# Altium schematic sheet 新版基于TL494的程控电源总图（17级训练）.SchDoc
size A4
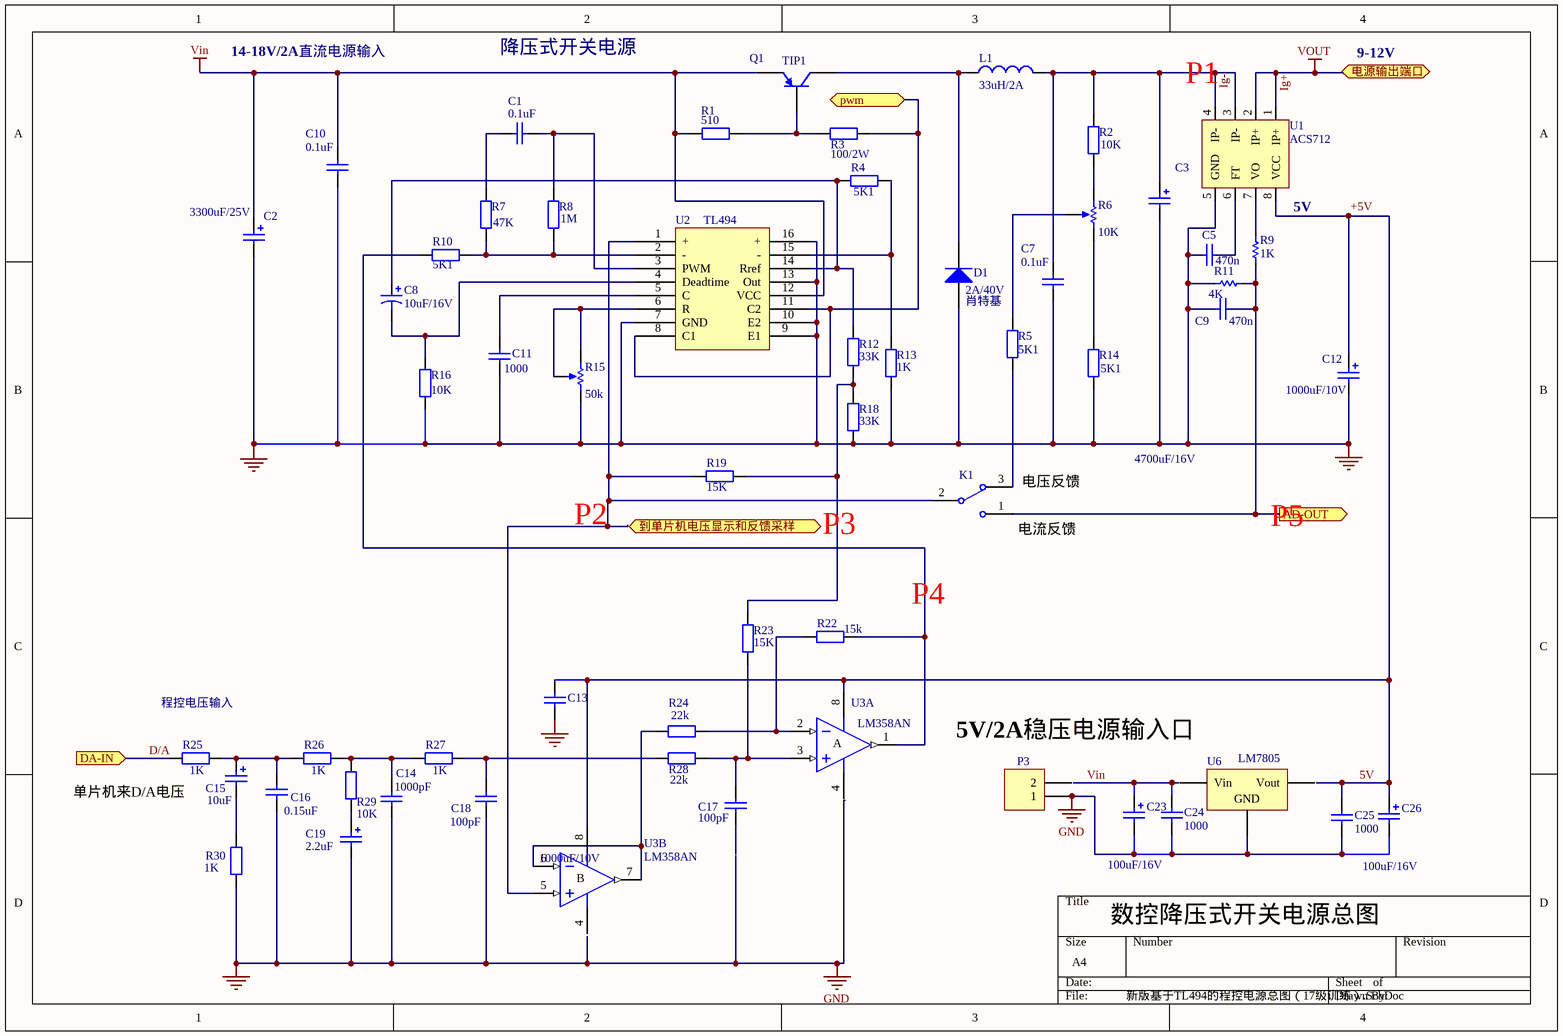
[diagram p0: 新版基于TL494的程控电源总图（17级训练）.SchDoc]

## Parts
C1  value 0.1uF  [Cap]  (hidden comment: Cap)
C2  value 3300uF/25V  [POLAR0.8]  (hidden comment: Cap Pol2)
C3  value 4700uF/16V  [POLAR0.8]  (hidden comment: Cap Pol2)
C5  value 470n  [1206]  (hidden comment: 275VAC)
C7  value 0.1uF  [RAD-0.3]  (hidden comment: Cap)
C8  value 10uF/16V  [RB7.6-15]  (hidden comment: Cap Pol1)
C9  value 470n  [1206]  (hidden comment: 275VAC)
C10  value 0.1uF  [RAD-0.3]  (hidden comment: Cap)
C11  value 1000  [Cap]  (hidden comment: Cap)
C12  value 1000uF/10V  [POLAR0.8]  (hidden comment: Cap Pol2)
C13  value 1000uF/10V  [RAD-0.3]  (hidden comment: Cap)
C14  value 1000pF  [RAD-0.3]  (hidden comment: Cap)
C15  value 10uF  [RAD-0.3]  (hidden comment: Cap Pol2)
C16  value 0.15uF  [RAD-0.3]  (hidden comment: Cap)
C17  value 100pF  [C1206]  (hidden comment: Cap Semi)
C18  value 100pF  [RAD-0.3]  (hidden comment: Cap)
C19  value 2.2uF  [RAD-0.3]  (hidden comment: Cap Pol2)
C23  value 100uF/16V  [POLAR0.8]  (hidden comment: Cap Pol2)
C24  value 1000  [RAD-0.3]  (hidden comment: Cap)
C25  value 1000  [RAD-0.3]  (hidden comment: Cap)
C26  value 100uF/16V  [POLAR0.8]  (hidden comment: Cap Pol2)
D1  2A/40V  PackageReference: 肖特基  [SMC]
K1  SW-SPDT  [TL36WW15050]  (value not drawn)
L1  value 33uH/2A  [INDC3216]  (hidden comment: Inductor)
P3  MHDR1X2  [MHDR1X2]  (value not drawn)
R1  value 510  [AXIAL-0.4]  (hidden comment: Res2)
R2  value 10K  [AXIAL-0.4]  (hidden comment: Res2)
R3  value 100/2W  [AXIAL-0.4]  (hidden comment: Res2)
R4  value 5K1  [AXIAL-0.4]  (hidden comment: Res2)
R5  value 5K1  [AXIAL-0.4]  (hidden comment: Res2)
R6  value 10K  [VR5]  (hidden comment: RPot)
R7  value 47K  [AXIAL-0.4]  (hidden comment: Res2)
R8  value 1M  [AXIAL-0.4]  (hidden comment: Res2)
R9  value 1K  [1206]  (hidden comment: 1/4W)
R10  value 5K1  [AXIAL-0.4]  (hidden comment: Res2)
R11  value 4K  [1206]  (hidden comment: 1/4W)
R12  value 33K  [AXIAL-0.4]  (hidden comment: Res2)
R13  value 1K  [AXIAL-0.4]  (hidden comment: Res2)
R14  value 5K1  [AXIAL-0.4]  (hidden comment: Res2)
R15  value 50k  [VR5]  (hidden comment: RPot)
R16  value 10K  [AXIAL-0.4]  (hidden comment: Res2)
R18  value 33K  [AXIAL-0.4]  (hidden comment: Res2)
R19  value 15K  [AXIAL-0.4]  (hidden comment: Res2)
R22  value 15k  [AXIAL-0.3]  (hidden comment: Res2)
R23  value 15K  [AXIAL-0.4]  (hidden comment: Res2)
R24  value 22k  [AXIAL-0.3]  (hidden comment: Res2)
R25  value 1K  [AXIAL-0.4]  (hidden comment: Res2)
R26  value 1K  [AXIAL-0.4]  (hidden comment: Res2)
R27  value 1K  [AXIAL-0.4]  (hidden comment: Res2)
R28  value 22k  [AXIAL-0.3]  (hidden comment: Res2)
R29  value 10K  [AXIAL-0.4]  (hidden comment: Res2)
R30  value 1K  [AXIAL-0.4]  (hidden comment: Res2)
TIP1  Q1  [SOT-23B_N]
U1  ACS712  [IR2111S_dip]
U2  TL494  [DIP16]
U3  LM358AN  [DIP-14]  (parts A,B of 4)
U6  LM7805  [D2PAK]

## Ports
AD-OUT (out), DA-IN (in), pwm, 到单片机电压显示和反馈采样 (out), 电源输出端口

## Nets
GND: C2.2 C3.2 C5.1 C7.1 C9.2 C10.1 C11.1 C12.2 C13.1 C14.1 C16.1 C18.1 C19.2 C23.2 C24.1 C25.1 C26.2 D1.1(A) P3.1 R11.1 R13.1 R14.1 R15.2(BOT) R16.1 R18.1 R30.1 U1.5(GND) U2.7(GND) U2.9(E1) U2.10(E2) U2.13(Out) U2.16(+) U6.2(GND)
Ig+: U1.1(IP+) U1.2(IP+)  [also labelled VOUT]
Vin: C23.1 C24.2
5V: C12.1 C13.2 C25.2 C26.1 U1.8(VCC) U3.8(V+)
AD-OUT: C9.1 K1.1 R9.2 R11.2 ; port AD-OUT
D/A: R25.1 ; port DA-IN
Ig-: C3.1 C7.2 L1.2 R2.2 U1.3(IP-) U1.4(IP-)
pwm: R3.2 U2.8(C1) U2.11(C2) ; port pwm
NetC1_1: C1.1 R8.2 U2.3(PWM)
NetC1_2: C1.2 R7.2
NetC2_1: C2.1 C10.2 R1.1 TIP1.3(E) U2.12(VCC)
NetC5_2: C5.2 U1.6(FT)
NetC8_1: C8.1 R4.1 R12.2 U2.14(Rref)
NetC8_2: C8.2 R16.2 U2.4(Deadtime)
NetC11_2: C11.2 U2.5(C)
NetC14_2: C14.2 R26.2 R27.1 R29.2
NetC15_1: C15.1 C16.2 R25.2 R26.1
NetC15_2: C15.2 R30.2
NetC17_2: C17.2 R23.1 R28.2 U3.3(IN+)
NetC18_2: C18.2 R27.2 R28.1
NetC19_1: C19.1 R29.1
NetD1_2: D1.2(K) L1.1 TIP1.1(C)
NetK1_2: K1.2 R19.2 U2.1(+) U3.5(IN+)
NetK1_3: K1.3 R5.1
NetR1_2: R1.2 R3.1 TIP1.2(B)
NetR2_1: R2.1 R6.1(TOP)
NetR4_2: R4.2 R13.2 U2.15(-)
NetR5_2: R5.2 R6.3(TAP)
NetR6_2: R6.2(BOT) R14.2
NetR7_1: R7.1 R8.1 R10.2 U2.2(-)
NetR9_1: R9.1 U1.7(VO)
NetR10_1: R10.1 R22.2 U3.1(OUT)
NetR12_1: R12.1 R18.2 R19.1 R23.2
NetR15_1: R15.1(TOP) R15.3(TAP) U2.6(R)
NetR22_1: R22.1 R24.2 U3.2(IN-)
NetR24_1: R24.1 U3.6(IN-) U3.7(OUT)

Not connected (* = marked no-connect by the designer): C17 1; P3 2; U3 4(V-); U6 1(Vin) 3(Vout)

## Notes on the sheet
- 14-18V/2A直流电源输入
- 降压式开关电源
- (near U1) P1
- 9-12V
- (near U1) 5V
- (near K1) 电压反馈
- P2
- P3
- (near K1) 电流反馈
- P5
- P4
- 程控电压输入
- (near P3) 5V/2A稳压电源输入口
- (near R25) 单片机来D/A电压
- 数控降压式开关电源总图
- Labels drawn without touching a wire or pin: +5V, Vin
- (in symbol LM324AN, part A) A
- (in symbol LM324AN, part B) B

## Library data of the parts
C1 C7 C10 C11 C13 C14 C16 C18 C24 C25 = Cap: Capacitor; Published: 8-Jun-2000; LatestRevisionDate: 17-Jul-2002; LatestRevisionNote: Re-released for DXP Platform.; PackageReference: RAD-0.3; Publisher: Altium Limited
  C1 C7 C10 C11: PackageDescription: Radial Cap, Thru-Hole; 2 Leads; 0.3 in Pin Spacing
C2 C3 C12 C15 C19 C23 C26 = Cap Pol2: Polarized Capacitor (Axial); Published: 8-Jun-2000; LatestRevisionDate: 17-Jul-2002; LatestRevisionNote: Re-released for DXP Platform.; PackageReference: POLAR0.8; Publisher: Altium Limited
C5 C9 = Cap: ECQ-U2A334ML; Published: 8-Jun-2000; LatestRevisionDate: 17-Jul-2002; LatestRevisionNote: Re-released for DXP Platform.; PackageReference: RAD-0.3; Publisher: Altium Limited
C8 = Cap Pol1: Polarized Capacitor (Radial); Published: 8-Jun-2000; LatestRevisionDate: 17-Jul-2002; LatestRevisionNote: Re-released for DXP Platform.; PackageReference: RB7.6-15; Publisher: Altium Limited; PackageDescription: Polarized Capacitor (Radial); 2 Leads
C17 = Cap Semi: Capacitor (Semiconductor SIM Model); Published: 8-Jun-2000; LatestRevisionDate: 17-Jul-2002; LatestRevisionNote: Re-released for DXP Platform.; PackageReference: C1206; Publisher: Altium Limited
D1 = Diode: Default Diode; Published: 8-Jun-2000; LatestRevisionDate: 17-Jul-2002; LatestRevisionNote: Re-released for DXP Platform.; PackageVersion: Sep-1996; Publisher: Altium Limited; PackageDescription: DO-214-AB/SMC; 2 C-Bend Leads; Body 7.9 x 5.9 mm, inc. leads (LxW); Code_JEDEC: DO-214-AB
K1 = SW-SPDT: SPDT Subminiature Toggle Switch, Right Angle Mounting, Vertical Actuation; Published: 24-Mar-1999; LatestRevisionDate: 17-Dec-2003; LatestRevisionNote: Schematic revised, PCB Footprint replaced.; DatasheetDocument: 05-Dec-2000; PackageReference: TL36WW15050; Publisher: Altium Limited; ComponentLink1Description: Manufacturer Link; ComponentLink1URL: http://www.apem.com
L1 = Inductor: Code_IEC: 1005; Published: 8-Jun-2000; LatestRevisionDate: 29-May-2009; LatestRevisionNote: IPC-7351 Footprint Added.; PackageReference: 0402-A; Publisher: Altium Limited; PackageDescription: Chip Inductor; Code_JEITA: 0402
P3 = MHDR1X2: Header, 2-Pin; LatestRevisionDate: 17-Jul-2002; LatestRevisionNote: Re-released for DXP Platform.; Publisher: Altium Limited
R1-R5 R7 R8 R10 R12-R14 R16 R18 R19 R22-R30 = Res2: Resistor; Published: 8-Jun-2000; LatestRevisionDate: 17-Jul-2002; LatestRevisionNote: Re-released for DXP Platform.; Publisher: Altium Limited
  R1-R5 R7 R8 R10 R12-R14 R16 R18 R19 R23: PackageReference: AXIAL-0.4; PackageDescription: Axial Device, Thru-Hole; 2 Leads; 0.4 in Pin Spacing
  R25-R27 R29 R30: PackageReference: AXIAL-0.4
R6 R15 = RPot: Potentiometer; Sim Note: Enter the Resistance value and the set point into parameter fields.; Set Position: 0.5; Published: 8-Jun-2000; LatestRevisionDate: 17-Jul-2002; LatestRevisionNote: Re-released for DXP Platform.; PackageReference: VR5; Publisher: Altium Limited; PackageDescription: Variable Resistor, Thru-Hole; 3 Leads
R9 R11 = Res1: ERJ-8GEYJ2R0V; Published: 8-Jun-2000; LatestRevisionDate: 17-Jul-2002; LatestRevisionNote: Re-released for DXP Platform.; PackageReference: AXIAL-0.3; Publisher: Altium Limited
TIP1 = PNP: PNP Bipolar Transistor; Published: 8-Jun-2000; LatestRevisionDate: 29-May-2009; LatestRevisionNote: IPC-7351 Footprint Added.; PackageVersion: Aug-1999; PackageReference: SOT-23B; Publisher: Altium Limited; PackageDescription: 3-Pin SOT-23 Package 0.95 mm Pitch, 2.4 mm Lead Span
U3 = LM324AN: Low-Power Quad Operational Amplifier; Published: 24-Aug-2001; LatestRevisionDate: 17-Jul-2002; LatestRevisionNote: Re-released for DXP Platform.; DatasheetDocument: Nov-1997; PackageDocument: Jan-1997; PackageReference: DIP14; Publisher: Altium Limited
U6 = Volt Reg: Voltage Regulator; Published: 24-Mar-1999; LatestRevisionDate: 17-Jul-2002; LatestRevisionNote: Re-released for DXP Platform.; PackageReference: D2PAK; Publisher: Altium Limited; Code_JEDEC: SMD-220